# Altium schematic sheet main.SchDoc
size A4
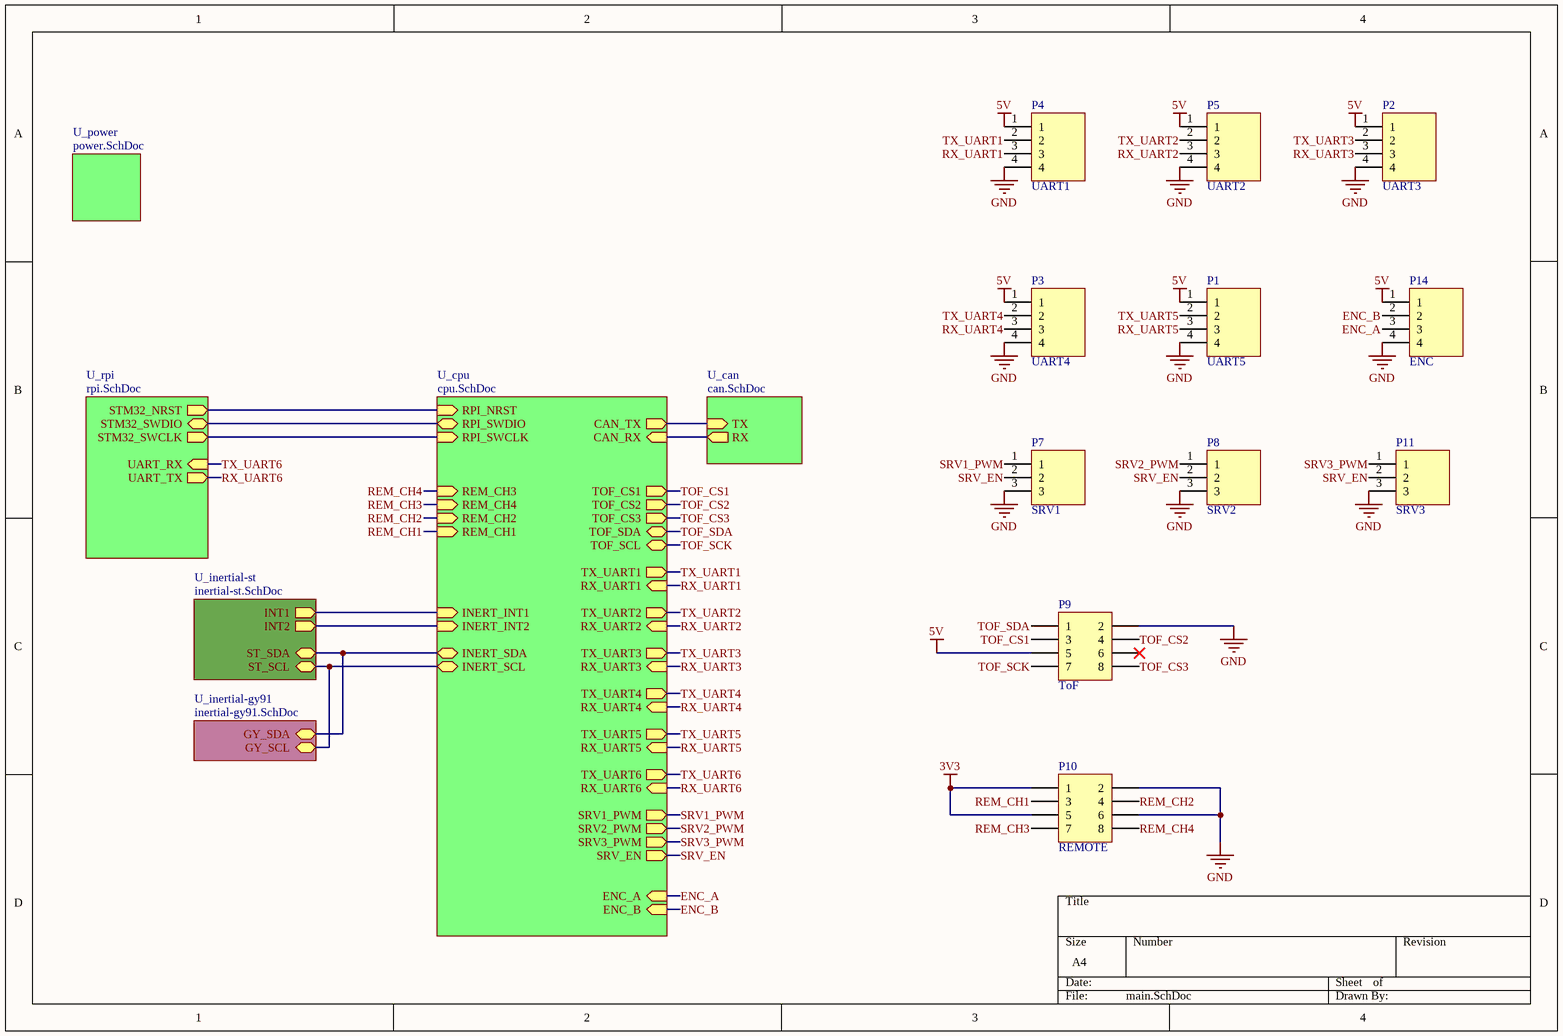
[diagram p0: main.SchDoc]

## Parts
P1  UART5  [FP_CONN4_TAP_254MM_90_NOPRINT]
P2  UART3  [FP_CONN4_TAP_254MM_90_NOPRINT]
P3  UART4  [FP_CONN4_TAP_254MM_90_NOPRINT]
P4  UART1  [FP_CONN4_TAP_254MM_90_NOPRINT]
P5  UART2  [FP_CONN4_TAP_254MM_90_NOPRINT]
P7  SRV1  [FP_CONN3_TAP_254MM_90_NOPRINT]
P8  SRV2  [FP_CONN3_TAP_254MM_90_NOPRINT]
P9  ToF  [HEADER-2X4]
P10  REMOTE  [HEADER-2X4]
P11  SRV3  [FP_CONN3_TAP_254MM_90_NOPRINT]
P14  ENC  [FP_CONN4_TAP_254MM_90_NOPRINT]

## Sub-sheets
U_can = can.SchDoc: TX (in), RX (out)
U_cpu = cpu.SchDoc: RPI_NRST (in), TOF_CS1 (out), TOF_CS2 (out), TOF_SCL (bidir), TOF_CS3 (out), TOF_SDA (bidir), RPI_SWDIO (bidir), RPI_SWCLK (in), REM_CH3 (in), REM_CH4 (in), REM_CH2 (in), REM_CH1 (in), RX_UART6 (in), RX_UART3 (in), TX_UART2 (out), RX_UART5 (in), TX_UART1 (out), TX_UART5 (out), RX_UART4 (in), TX_UART4 (out), TX_UART3 (out), RX_UART2 (in), RX_UART1 (in), TX_UART6 (out), INERT_SCL (bidir), INERT_SDA (bidir), INERT_INT2 (in), INERT_INT1 (in), SRV1_PWM (out), SRV2_PWM (out), SRV3_PWM (out), SRV_EN (out), ENC_A (in), ENC_B (in), CAN_TX (out), CAN_RX (in)
U_inertial-gy91 = inertial-gy91.SchDoc: GY_SCL (bidir), GY_SDA (bidir)
U_inertial-st = inertial-st.SchDoc: INT1 (out), INT2 (out), ST_SDA (bidir), ST_SCL (bidir)
U_power = power.SchDoc: no entries
U_rpi = rpi.SchDoc: STM32_NRST (out), STM32_SWDIO (bidir), STM32_SWCLK (out), UART_RX (in), UART_TX (out)

## Nets
3V3: P10.1 P10.5
5V: P1.1 P2.1 P3.1 P4.1 P5.1 P9.5 P14.1
GND: P1.4 P2.4 P3.4 P4.4 P5.4 P7.3 P8.3 P9.2 P10.2 P10.6 P11.3 P14.4
ENC_A: P14.3 ; sheet U_cpu/ENC_A
ENC_B: P14.2 ; sheet U_cpu/ENC_B
REM_CH1: P10.3 ; sheet U_cpu/REM_CH1
REM_CH2: P10.4 ; sheet U_cpu/REM_CH2
REM_CH3: P10.7 ; sheet U_cpu/REM_CH4
REM_CH4: P10.8 ; sheet U_cpu/REM_CH3
RX_UART1: P4.3 ; sheet U_cpu/RX_UART1
RX_UART2: P5.3 ; sheet U_cpu/RX_UART2
RX_UART3: P2.3 ; sheet U_cpu/RX_UART3
RX_UART4: P3.3 ; sheet U_cpu/RX_UART4
RX_UART5: P1.3 ; sheet U_cpu/RX_UART5
RX_UART6: sheet U_cpu/RX_UART6, sheet U_rpi/UART_TX
SRV1_PWM: P7.1 ; sheet U_cpu/SRV1_PWM
SRV2_PWM: P8.1 ; sheet U_cpu/SRV2_PWM
SRV3_PWM: P11.1 ; sheet U_cpu/SRV3_PWM
SRV_EN: P7.2 P8.2 P11.2 ; sheet U_cpu/SRV_EN
TOF_CS1: P9.3 ; sheet U_cpu/TOF_CS1
TOF_CS2: P9.4 ; sheet U_cpu/TOF_CS2
TOF_CS3: P9.8 ; sheet U_cpu/TOF_CS3
TOF_SCK: P9.7 ; sheet U_cpu/TOF_SCL
TOF_SDA: P9.1 ; sheet U_cpu/TOF_SDA
TX_UART1: P4.2 ; sheet U_cpu/TX_UART1
TX_UART2: P5.2 ; sheet U_cpu/TX_UART2
TX_UART3: P2.2 ; sheet U_cpu/TX_UART3
TX_UART4: P3.2 ; sheet U_cpu/TX_UART4
TX_UART5: P1.2 ; sheet U_cpu/TX_UART5
TX_UART6: sheet U_cpu/TX_UART6, sheet U_rpi/UART_RX
(unnamed): sheet U_cpu/RPI_NRST, sheet U_rpi/STM32_NRST
(unnamed): sheet U_cpu/RPI_SWDIO, sheet U_rpi/STM32_SWDIO
(unnamed): sheet U_cpu/RPI_SWCLK, sheet U_rpi/STM32_SWCLK
(unnamed): sheet U_cpu/INERT_SCL, sheet U_inertial-gy91/GY_SCL, sheet U_inertial-st/ST_SCL
(unnamed): sheet U_cpu/INERT_SDA, sheet U_inertial-gy91/GY_SDA, sheet U_inertial-st/ST_SDA
(unnamed): sheet U_cpu/INERT_INT2, sheet U_inertial-st/INT2
(unnamed): sheet U_cpu/INERT_INT1, sheet U_inertial-st/INT1
(unnamed): sheet U_cpu/CAN_TX, sheet U_can/TX
(unnamed): sheet U_cpu/CAN_RX, sheet U_can/RX

Not connected (* = marked no-connect by the designer): P9 6*

## Library data of the parts
P1-P5 P14 = Connector_4pin: 4pin Connector
P7 P8 P11 = Connector_3pin: 3pin connector
P9 P10 = Header 4X2: Header, 4-Pin, Dual row; LatestRevisionDate: 17-Jul-2002; LatestRevisionNote: Re-released for DXP Platform.; Publisher: Altium Limited